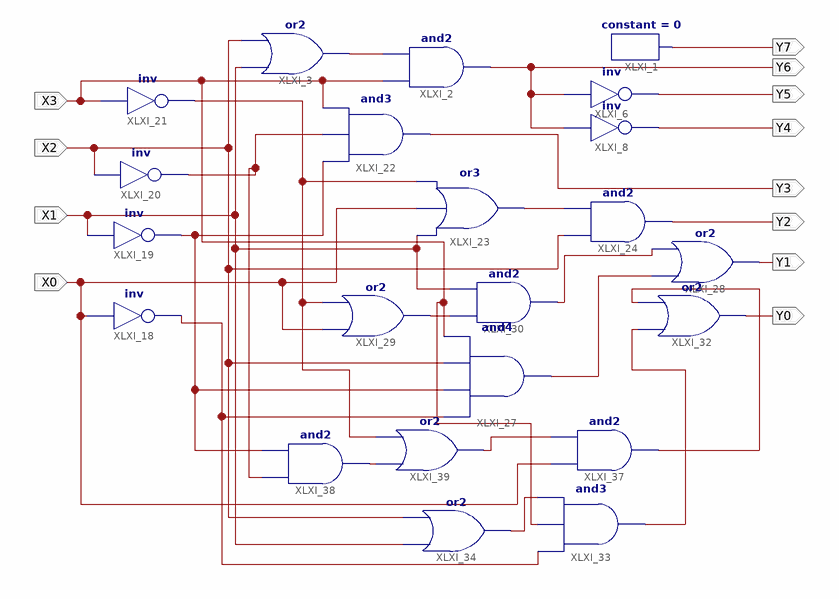
[diagram p0: schematic sheet 1]
// Xilinx ISE schematic zad3_sch.sch (artix7) as structural Verilog: 22 symbols, 13 ports
module zad3_sch (
  input  XLXN_183,
  input  X2,
  input  X1,
  input  X0,
  input  X3,
  output Y6,
  output Y4,
  output Y5,
  output Y3,
  output Y2,
  output Y0,
  output Y1,
  output Y7
);

  wire XLXN_40, XLXN_95, XLXN_97, XLXN_99, XLXN_103, XLXN_106, XLXN_107, XLXN_110, XLXN_111, XLXN_141,
       XLXN_175, XLXN_198, XLXN_199, XLXN_202;

  and XLXI_2 (Y6, X3, XLXN_40);
  or XLXI_3 (XLXN_40, X1, X2);
  not XLXI_6 (Y5, Y6);
  not XLXI_8 (Y4, Y6);
  not XLXI_18 (XLXN_111, X0);
  not XLXI_19 (XLXN_110, X1);
  not XLXI_20 (XLXN_95, X2);
  not XLXI_21 (XLXN_97, X3);
  and XLXI_22 (Y3, XLXN_110, XLXN_95, X3);
  or XLXI_23 (XLXN_99, X1, X0, XLXN_97);
  and XLXI_24 (Y2, X2, XLXN_99);
  and XLXI_27 (XLXN_107, XLXN_111, XLXN_110, X2, X3);
  or XLXI_28 (Y1, XLXN_107, XLXN_106);
  or XLXI_29 (XLXN_103, X0, XLXN_97);
  and XLXI_30 (XLXN_106, XLXN_103, X1);
  or XLXI_32 (Y0, XLXN_202, XLXN_199);
  and XLXI_33 (XLXN_202, XLXN_111, X3, XLXN_198);
  or XLXI_34 (XLXN_198, X1, X2);
  and XLXI_38 (XLXN_141, XLXN_95, XLXN_110);
  or XLXI_39 (XLXN_175, XLXN_141, XLXN_97);
  and XLXI_37 (XLXN_199, X0, XLXN_175);
  constant #(.CValue("0")) XLXI_1 (.O(Y7));
endmodule
